# EasyEDA Pro project ProDoc_OHPP-005B.epro, schematic OHPP-005B

## Sheets
1 P1: Board Name: Board1; Create Date: 2025-08-12; Page Name: P1; Project Name: OHPP-005-Breakout Adapter for Radio Boards; Schematic Name: Schematic1; Update Date: 2025-08-12; Company: EasyEDA.com; Page Size: A4; Version: V1.0
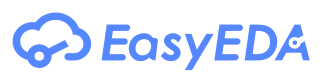
[diagram p0: P1]
2 P2: Page Name: P2
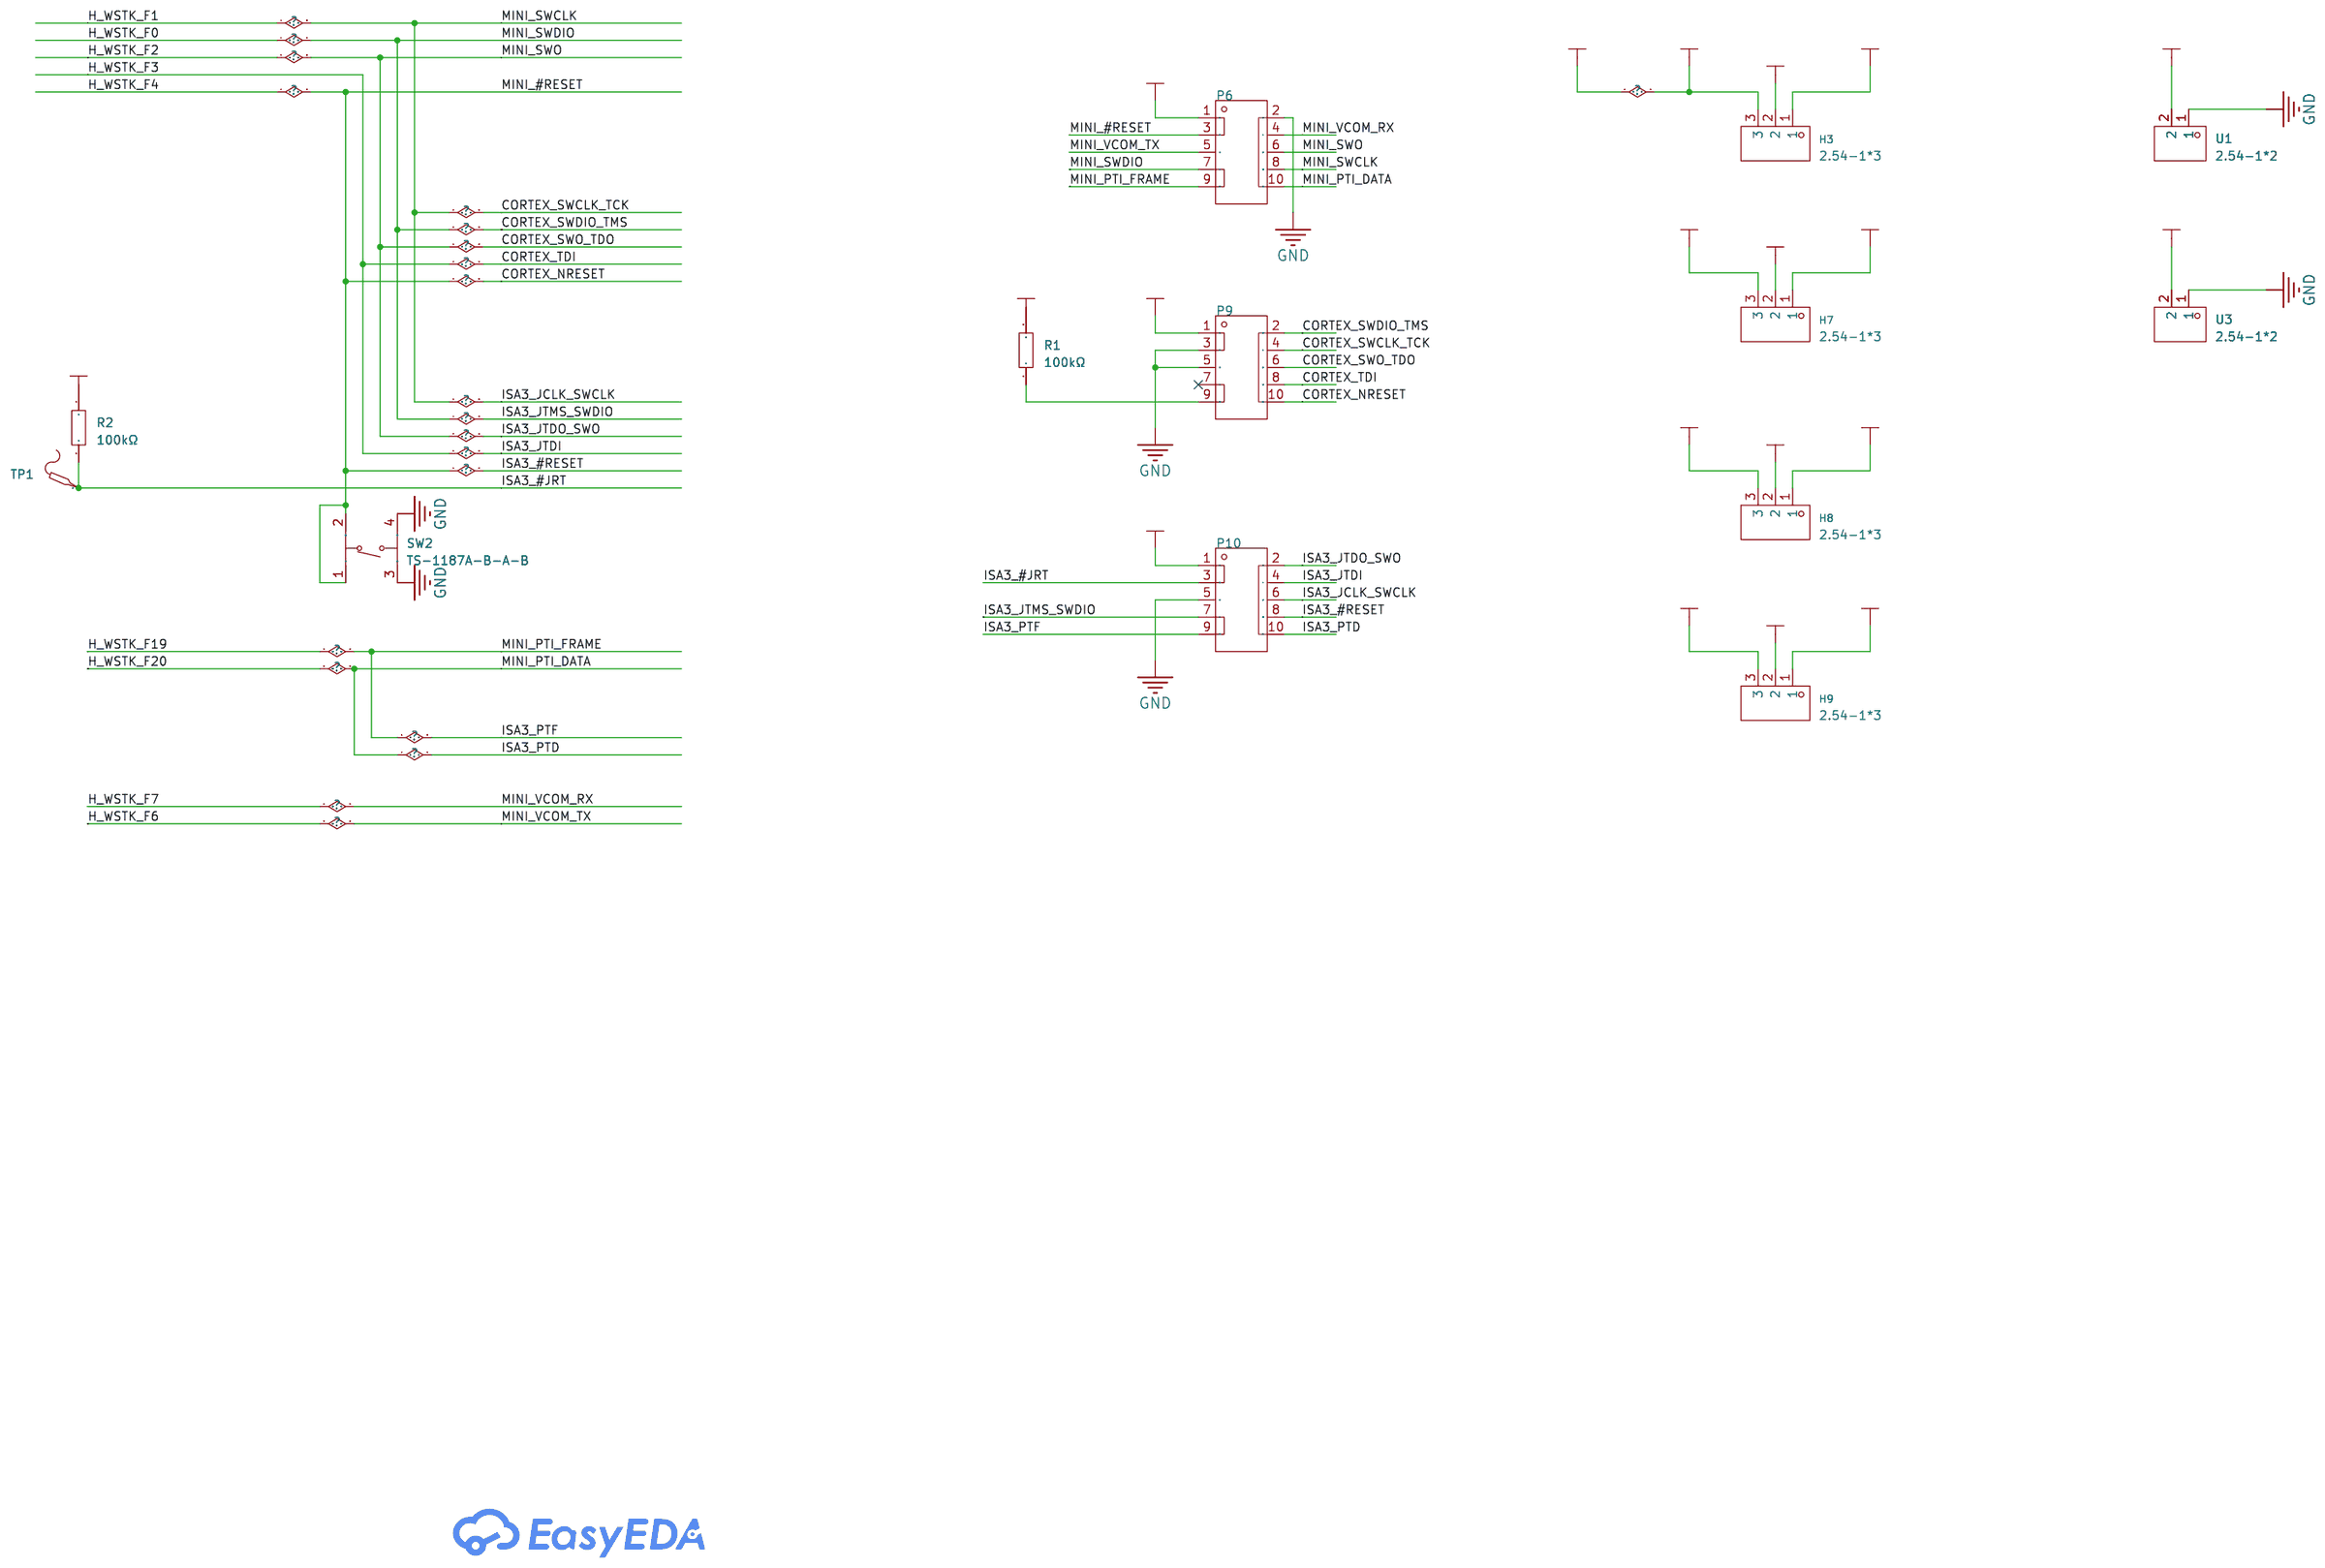
[diagram p1: P2]
3 P3: Board Name: OHPP-005B; Page Name: P3; Schematic Name: OHPP-005B; Update Date: 2025-08-13
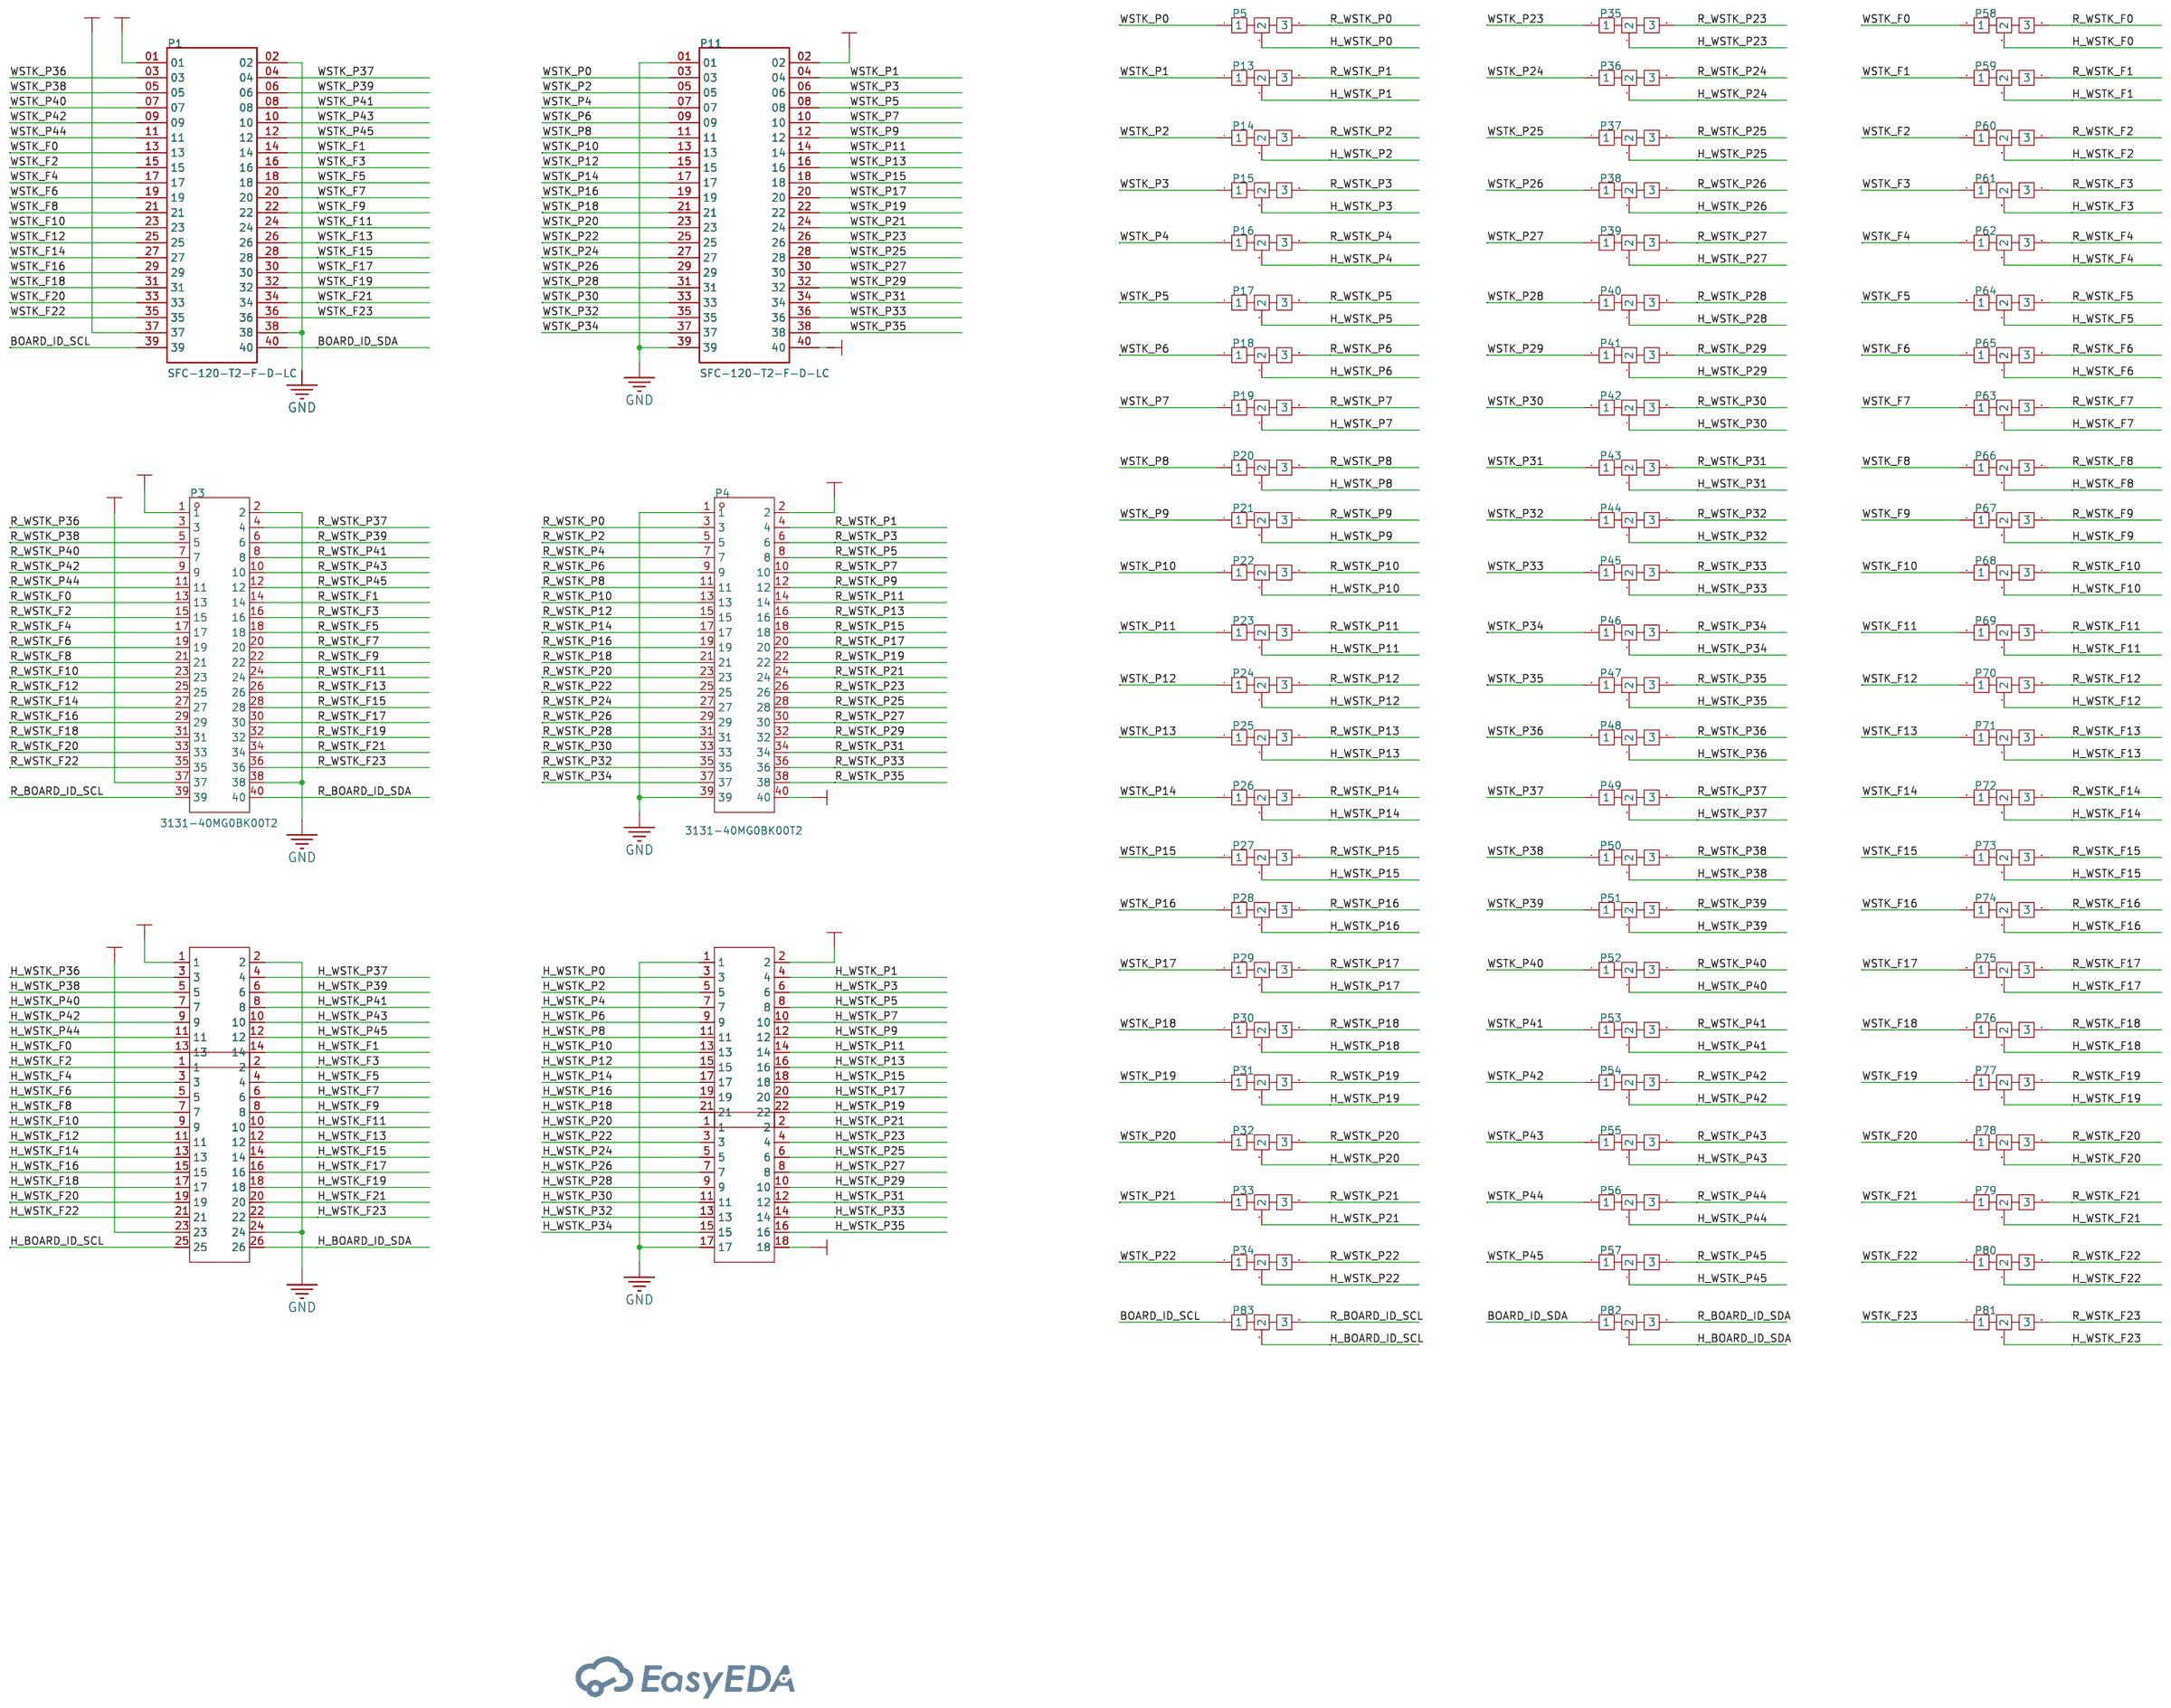
[diagram p2: P3]

## Parts
sheet P2
H3  2.54-1*3  [HDR-TH_3P-P2.54-V-M-1]
H7  2.54-1*3  [HDR-TH_3P-P2.54-V-M-1]
H8  2.54-1*3  [HDR-TH_3P-P2.54-V-M-1]
H9  2.54-1*3  [HDR-TH_3P-P2.54-V-M-1]
P6  23bddce16d364f51bbc85156d37ba6bb  [IDC-SMD_3132-10MG0BK00R2_1]
P9  23bddce16d364f51bbc85156d37ba6bb  [IDC-SMD_3132-10MG0BK00R2_1]
P10  23bddce16d364f51bbc85156d37ba6bb  [IDC-SMD_3132-10MG0BK00R2_1]
R1  100kΩ  [R0603]
R2  100kΩ  [R0603]
SW2  TS-1187A-B-A-B  [SW-SMD_4P-L5.1-W5.1-P3.70-LS6.5-TL_H1.5]
TP1  -  [Test-Point-0.5mm]
U1  2.54-1*2  [HDR-TH_2P-P2.54-V-M]
U3  2.54-1*2  [HDR-TH_2P-P2.54-V-M]
sheet P3
H15  X6521WV-2x09H-C60D30  [HDR-TH_18P-P2.54-V-M-R2-C9-S2.54]
H16  X6521WV-2x11H-C60D30  [HDR-TH_22P-2.54-V-M-R2-C11-S2.54]
H17  X6521WV-2x13H-C60D30  [HDR-TH_26P-P2.54-V-M-R2-C13-S2.54]
H18  X6521WV-2x07H-C60D30  [HDR-TH_14P-P2.54-V-M-R2-C7-S2.54]
P1  *  [SAMTEC_SFC-120-T2-F-D-LC_1]
P3  3131-40MG0BK00T2  [CONN-SMD_40P-P1.27_WCON_3131-40MG0BK00T2_1]
P4  3131-40MG0BK00T2  [CONN-SMD_40P-P1.27_WCON_3131-40MG0BK00T2_1]
P5  -  [JUMPER_RECT_3PIN_NSNS]
P11  *  [SAMTEC_SFC-120-T2-F-D-LC_1]
P13  -  [JUMPER_RECT_3PIN_NSNS]
P14  -  [JUMPER_RECT_3PIN_NSNS]
P15  -  [JUMPER_RECT_3PIN_NSNS]
P16  -  [JUMPER_RECT_3PIN_NSNS]
P17  -  [JUMPER_RECT_3PIN_NSNS]
P18  -  [JUMPER_RECT_3PIN_NSNS]
P19  -  [JUMPER_RECT_3PIN_NSNS]
P20  -  [JUMPER_RECT_3PIN_NSNS]
P21  -  [JUMPER_RECT_3PIN_NSNS]
P22  -  [JUMPER_RECT_3PIN_NSNS]
P23  -  [JUMPER_RECT_3PIN_NSNS]
P24  -  [JUMPER_RECT_3PIN_NSNS]
P25  -  [JUMPER_RECT_3PIN_NSNS]
P26  -  [JUMPER_RECT_3PIN_NSNS]
P27  -  [JUMPER_RECT_3PIN_NSNS]
P28  -  [JUMPER_RECT_3PIN_NSNS]
P29  -  [JUMPER_RECT_3PIN_NSNS]
P30  -  [JUMPER_RECT_3PIN_NSNS]
P31  -  [JUMPER_RECT_3PIN_NSNS]
P32  -  [JUMPER_RECT_3PIN_NSNS]
P33  -  [JUMPER_RECT_3PIN_NSNS]
P34  -  [JUMPER_RECT_3PIN_NSNS]
P35  -  [JUMPER_RECT_3PIN_NSNS]
P36  -  [JUMPER_RECT_3PIN_NSNS]
P37  -  [JUMPER_RECT_3PIN_NSNS]
P38  -  [JUMPER_RECT_3PIN_NSNS]
P39  -  [JUMPER_RECT_3PIN_NSNS]
P40  -  [JUMPER_RECT_3PIN_NSNS]
P41  -  [JUMPER_RECT_3PIN_NSNS]
P42  -  [JUMPER_RECT_3PIN_NSNS]
P43  -  [JUMPER_RECT_3PIN_NSNS]
P44  -  [JUMPER_RECT_3PIN_NSNS]
P45  -  [JUMPER_RECT_3PIN_NSNS]
P46  -  [JUMPER_RECT_3PIN_NSNS]
P47  -  [JUMPER_RECT_3PIN_NSNS]
P48  -  [JUMPER_RECT_3PIN_NSNS]
P49  -  [JUMPER_RECT_3PIN_NSNS]
P50  -  [JUMPER_RECT_3PIN_NSNS]
P51  -  [JUMPER_RECT_3PIN_NSNS]
P52  -  [JUMPER_RECT_3PIN_NSNS]
P53  -  [JUMPER_RECT_3PIN_NSNS]
P54  -  [JUMPER_RECT_3PIN_NSNS]
P55  -  [JUMPER_RECT_3PIN_NSNS]
P56  -  [JUMPER_RECT_3PIN_NSNS]
P57  -  [JUMPER_RECT_3PIN_NSNS]
P58  -  [JUMPER_RECT_3PIN_NSNS]
P59  -  [JUMPER_RECT_3PIN_NSNS]
P60  -  [JUMPER_RECT_3PIN_NSNS]
P61  -  [JUMPER_RECT_3PIN_NSNS]
P62  -  [JUMPER_RECT_3PIN_NSNS]
P63  -  [JUMPER_RECT_3PIN_NSNS]
P64  -  [JUMPER_RECT_3PIN_NSNS]
P65  -  [JUMPER_RECT_3PIN_NSNS]
P66  -  [JUMPER_RECT_3PIN_NSNS]
P67  -  [JUMPER_RECT_3PIN_NSNS]
P68  -  [JUMPER_RECT_3PIN_NSNS]
P69  -  [JUMPER_RECT_3PIN_NSNS]
P70  -  [JUMPER_RECT_3PIN_NSNS]
P71  -  [JUMPER_RECT_3PIN_NSNS]
P72  -  [JUMPER_RECT_3PIN_NSNS]
P73  -  [JUMPER_RECT_3PIN_NSNS]
P74  -  [JUMPER_RECT_3PIN_NSNS]
P75  -  [JUMPER_RECT_3PIN_NSNS]
P76  -  [JUMPER_RECT_3PIN_NSNS]
P77  -  [JUMPER_RECT_3PIN_NSNS]
P78  -  [JUMPER_RECT_3PIN_NSNS]
P79  -  [JUMPER_RECT_3PIN_NSNS]
P80  -  [JUMPER_RECT_3PIN_NSNS]
P81  -  [JUMPER_RECT_3PIN_NSNS]
P82  -  [JUMPER_RECT_3PIN_NSNS]
P83  -  [JUMPER_RECT_3PIN_NSNS]

## Library data of the parts
H3 H7-H9 = 2.54-1*3: Pin Structure:1x3P Pitch:2.54mm Number of Rows:Plugin Number of Pins:3P Contact Plating:Gold; LCSC Part Name: 停产; Supplier Part: C5116482; Manufacturer: ZHOURI(洲日); Supplier Footprint: 插件,P=2.54mm; Datasheet: https://atta.szlcsc.com/upload/public/pdf/source/20220729/4DB71EF9013296CFACD97372BAB8A1F0.pdf; Supplier: LCSC; Pin Structure: 1x3P; Pitch: 2.54mm; Number of Rows: Plugin; Number of Pins: 3P; Contact Plating: Gold
P6 P9 P10 = 3132-10MG0BK00R2_CP_V1.0.0: Connector Type:简牛座 Pitch:1.27mm Structure:2x5P Holder Type:Brick nogging Row Spacing:1.27mm Number of Rows:2 Pin Number in each Row:5 Contact Material:Brass Contact Plating:Gold; Supplier: LCSC; Supplier Part: C783843; Manufacturer: Wcon(维峰电子); Manufacturer Part: 3132-10MG0BK00R2; LCSC Part Name: 1.27mm 2x5P 排数:2 每排P数:5; Supplier Footprint: SMD,P=1.27mm; Datasheet: https://atta.szlcsc.com/upload/public/pdf/source/20200914/C783843_74B4F3B0F5055CA38342214C72674E3E.pdf; Connector Type: 简牛座; Pitch: 1.27mm; Structure: 2x5P; Holder Type: Brick nogging; Row Spacing: 1.27mm; Number of Rows: 2; Pin Number in each Row: 5; Contact Material: Brass; Contact Plating: Gold
R1 R2 = 0603WAF1003T5E: Type:Thick Film Resistors Resistance:100kΩ Tolerance:±1% Tolerance:±1% Power(Watts): Overload Voltage (Max): Temperature Coefficient:±100ppm/℃ Temperature Coefficient:±100ppm/℃ Operating Temperature Range:-55℃~+155℃ Operating Temperature Range:-55℃~+155℃; LCSC Part Name: 100kΩ ±1% 100mW 厚膜电阻; Supplier Part: C25803; Manufacturer: UNI-ROYAL(厚声); Supplier Footprint: 0603; JLCPCB Part Class: Basic Part; Datasheet: https://atta.szlcsc.com/upload/public/pdf/source/20200306/C422600_1E6D84923E4A46A82E41ADD87F860B5C.pdf; Supplier: LCSC; Type: Thick Film Resistors; Tolerance: ±1%; Temperature Coefficient: ±100ppm/℃; Operating Temperature Range: -55℃~+155℃
SW2 = TS-1187A-B-A-B: Circuit:SPST Actuator Style:Round Button Operating Force:160gf Mounting Style:Brick nogging Switch Length:5.1mm Switch Width:5.1mm Switch Height:1.5mm Strike Gundam:不带 Contact Current:50mA Voltage Rating (DC):12V Insulation Resistance:- Actuator/Cap Color; LCSC Part Name: 5.1*5.1*1.5mm 立贴 轻触开关; Supplier Part: C318884; Manufacturer: XKB Connectivity(中国星坤); Supplier Footprint: SMD; JLCPCB Part Class: Basic Part; Datasheet: https://atta.szlcsc.com/upload/public/pdf/source/20200227/C318890_053E50208A88A7BA1965D8746000774E.pdf; Supplier: LCSC; Circuit: SPST; Actuator Style: Round Button; Operating Force: 160gf; Mounting Style: Brick nogging; Switch Length: 5.1mm; Switch Width: 5.1mm; Switch Height: 1.5mm; Strike Gundam: 不带; Contact Current: 50mA; Voltage Rating (DC): 12V; Actuator/Cap Color: 金色; With Lamp: No; Mechanical Life: 10万次; Operating Temperature: -30℃~+85℃
TP1 = Test-Point: Test Point 测试点
U1 U3 = 2.54-1*2: Pin Structure:1x2P Pitch:2.54mm Number of Rows:Plugin Number of Pins:2P Contact Plating:Gold; LCSC Part Name: 停产; Supplier Part: C5116481; Manufacturer: ZHOURI(洲日); Supplier Footprint: 插件,P=2.54mm; Datasheet: https://atta.szlcsc.com/upload/public/pdf/source/20220729/DF18AADA08AA3A4F1D3B0508BB8F7248.pdf; Supplier: LCSC; Pin Structure: 1x2P; Pitch: 2.54mm; Number of Rows: Plugin; Number of Pins: 2P; Contact Plating: Gold
H15 = X6521WV-2x09H-C60D30: Pin Structure:2x9P Pitch:2.54mm Row Spacing:2.54mm Circluar Pins/Square Pins:Pin Header Number of Rows:2 Number of Pins:18P Current Rating:3A Voltage Rating (Max):250V Length of Mating Pin:- Insulation Height:2.5mm Length of End Connection Pin:- Contact M; LCSC Part Name: 2x9P 间距:2.54mm 方针; Supplier Part: C706899; Manufacturer: XKB Connection(中国星坤); Supplier Footprint: 插件,P=2.54mm; JLCPCB Part Class: Extended Part; Datasheet: https://item.szlcsc.com/datasheet/X6521WV-2x09H-C60D30/744021.html; Supplier: LCSC; Pin Structure: 2x9P; Pitch: 2.54mm; Row Spacing: 2.54mm; Circluar Pins/Square Pins: Pin Header; Number of Rows: 2; Number of Pins: 18P; Current Rating: 3A; Voltage Rating (Max): 250V; Insulation Height: 2.5mm; Contact Material: Brass; Contact Plating: Gold; Operating Temperature: -40℃~+105℃; Color: Black
H16 = X6521WV-2x11H-C60D30: Pin Structure:2x11P Pitch:2.54mm Row Spacing:2.54mm Circluar Pins/Square Pins:Policy Number of Rows:Double Row Number of Pins:22P Current Rating:3A Voltage Rating (Max):250V Length of Mating Pin:- Insulation Height:2.5mm Length of End Connection Pin:- Con; LCSC Part Name: 2x11P 间距:2.54mm 方针; Supplier Part: C725883; Manufacturer: XKB Connection(中国星坤); Supplier Footprint: 插件,P=2.54mm; JLCPCB Part Class: Extended Part; Supplier: LCSC; Pin Structure: 2x11P; Pitch: 2.54mm; Row Spacing: 2.54mm; Circluar Pins/Square Pins: Policy; Number of Rows: Double Row; Number of Pins: 22P; Current Rating: 3A; Voltage Rating (Max): 250V; Insulation Height: 2.5mm; Contact Material: Brass; Contact Plating: Gold; Operating Temperature: -40℃~+105℃; Color: Black
H17 = X6521WV-2x13H-C60D30: Pin Structure:2x13P Pitch:2.54mm Row Spacing:2.54mm Circluar Pins/Square Pins:Pin Header Number of Rows:2 Number of Pins:26P Current Rating:3A Voltage Rating (Max):250V Length of Mating Pin:- Insulation Height:2.5mm Length of End Connection Pin:- Contact; LCSC Part Name: 2x13P 间距:2.54mm 方针; Supplier Part: C725885; Manufacturer: XKB Connection(中国星坤); Supplier Footprint: 插件,P=2.54mm; JLCPCB Part Class: Extended Part; Datasheet: https://item.szlcsc.com/datasheet/X6521WV-2x13H-C60D30/772334.html; Supplier: LCSC; Pin Structure: 2x13P; Pitch: 2.54mm; Row Spacing: 2.54mm; Circluar Pins/Square Pins: Pin Header; Number of Rows: 2; Number of Pins: 26P; Current Rating: 3A; Voltage Rating (Max): 250V; Insulation Height: 2.5mm; Contact Material: Brass; Contact Plating: Gold; Operating Temperature: -40℃~+105℃; Color: Black
H18 = X6521WV-2x07H-C60D30: Pin Structure:2x7P Pitch:2.54mm Row Spacing:2.54mm Circluar Pins/Square Pins:Pin Header Number of Rows:2 Number of Pins:14P Current Rating:3A Voltage Rating (Max):250V Length of Mating Pin:- Insulation Height:2.5mm Length of End Connection Pin:- Contact M; LCSC Part Name: 2x7P 间距:2.54mm 方针; Supplier Part: C706897; Manufacturer: XKB Connection(中国星坤); Supplier Footprint: 插件,P=2.54mm; JLCPCB Part Class: Extended Part; Supplier: LCSC; Pin Structure: 2x7P; Pitch: 2.54mm; Row Spacing: 2.54mm; Circluar Pins/Square Pins: Pin Header; Number of Rows: 2; Number of Pins: 14P; Current Rating: 3A; Voltage Rating (Max): 250V; Insulation Height: 2.5mm; Contact Material: Brass; Contact Plating: Gold; Operating Temperature: -40℃~+105℃; Color: Black
P1 P11 = SFC-120-T2-F-D-LC_CP-V1.0.0: Package1: None; Price: None; MP: SFC-120-T2-F-D-LC; Availability: Unavailable
P3 P4 = 3131-40MG0BK00T2_CP_V1.0.1: Connector Type:Simple cow constellation Pitch:1.27mm Number of Positions or Pins:2x20P Current Rating:1A Voltage Rating (Max):- Holder Type:Standing paste Row Spacing:1.27mm Number of Rows:2 Number of PINs Per Row:20 Operating Temperature:-40℃~+105℃ Opera; Supplier Part: C976753; Manufacturer: Wcon(维峰电子); Supplier Footprint: SMD,P=1.27mm; Datasheet: https://atta.szlcsc.com/upload/public/pdf/source/20211202/B702BBAB0AED51B28E1877A6EDDD5ECD.pdf; Supplier: LCSC; Connector Type: Simple cow constellation; Pitch: 1.27mm; Number of Positions or Pins: 2x20P; Current Rating: 1A; Holder Type: Standing paste; Row Spacing: 1.27mm; Number of Rows: 2; Number of PINs Per Row: 20; Operating Temperature: -40℃~+105℃
P5 P13-P83 = JUMPER_RECT_3PIN_NSNS

## Nets
3V3: H8.3 P1.01
5V: H9.3 P1.37
GND: H15.17 H16.1 H17.24 H18.2 P1.02 P1.38 P3.2 P3.38 P4.1 P4.39 P6.2 P9.3 P9.5 P10.5 P11.01 P11.39 SW2.3(C) SW2.4(D) U1.1 U3.1
BOARD_ID_SCL: P1.39 P83.1
BOARD_ID_SDA: P1.40 P82.1
CORTEX_NRESET: H17.3 P6.3 P9.10 P10.8 P62.2 SW2.1(A) SW2.2(B)
CORTEX_SWCLK_TCK: H18.14 P6.8 P9.4 P10.6 P59.2
CORTEX_SWDIO_TMS: H18.13 P6.7 P9.2 P10.7 P58.2
CORTEX_SWO_TDO: H17.1 P6.6 P9.6 P10.2 P60.2
CORTEX_TDI: H17.2 P9.8 P10.4 P61.2
EXT_3V3: H3.1 H7.1 H8.1 U1.2
EXT_5V: H9.1 U3.2
H_BOARD_ID_SCL: H17.25 P83.2
H_BOARD_ID_SDA: H17.26 P82.2
H_WSTK_F5: H17.4 P64.2
H_WSTK_F6: H17.5 P6.5 P65.2
H_WSTK_F7: H17.6 P6.4 P63.2
H_WSTK_F8: H17.7 P66.2
H_WSTK_F9: H17.8 P67.2
H_WSTK_F10: H17.9 P68.2
H_WSTK_F11: H17.10 P69.2
H_WSTK_F12: H17.11 P70.2
H_WSTK_F13: H17.12 P71.2
H_WSTK_F14: H17.13 P72.2
H_WSTK_F15: H17.14 P73.2
H_WSTK_F16: H17.15 P74.2
H_WSTK_F17: H17.16 P75.2
H_WSTK_F18: H17.17 P76.2
H_WSTK_F19: H17.18 P6.9 P10.9 P77.2
H_WSTK_F20: H17.19 P6.10 P10.10 P78.2
H_WSTK_F21: H17.20 P79.2
H_WSTK_F22: H17.21 P80.2
H_WSTK_F23: H17.22 P81.2
H_WSTK_P0: H16.3 P5.2
H_WSTK_P1: H16.4 P13.2
H_WSTK_P2: H16.5 P14.2
H_WSTK_P3: H16.6 P15.2
H_WSTK_P4: H16.7 P16.2
H_WSTK_P5: H16.8 P17.2
H_WSTK_P6: H16.9 P18.2
H_WSTK_P7: H16.10 P19.2
H_WSTK_P8: H16.11 P20.2
H_WSTK_P9: H16.12 P21.2
H_WSTK_P10: H16.13 P22.2
H_WSTK_P11: H16.14 P23.2
H_WSTK_P12: H16.15 P24.2
H_WSTK_P13: H16.16 P25.2
H_WSTK_P14: H16.17 P26.2
H_WSTK_P15: H16.18 P27.2
H_WSTK_P16: H16.19 P28.2
H_WSTK_P17: H16.20 P29.2
H_WSTK_P18: H16.21 P30.2
H_WSTK_P19: H16.22 P31.2
H_WSTK_P20: H15.1 P32.2
H_WSTK_P21: H15.2 P33.2
H_WSTK_P22: H15.3 P34.2
H_WSTK_P23: H15.4 P35.2
H_WSTK_P24: H15.5 P36.2
H_WSTK_P25: H15.6 P37.2
H_WSTK_P26: H15.7 P38.2
H_WSTK_P27: H15.8 P39.2
H_WSTK_P28: H15.9 P40.2
H_WSTK_P29: H15.10 P41.2
H_WSTK_P30: H15.11 P42.2
H_WSTK_P31: H15.12 P43.2
H_WSTK_P32: H15.13 P44.2
H_WSTK_P33: H15.14 P45.2
H_WSTK_P34: H15.15 P46.2
H_WSTK_P35: H15.16 P47.2
H_WSTK_P36: H18.3 P48.2
H_WSTK_P37: H18.4 P49.2
H_WSTK_P38: H18.5 P50.2
H_WSTK_P39: H18.6 P51.2
H_WSTK_P40: H18.7 P52.2
H_WSTK_P41: H18.8 P53.2
H_WSTK_P42: H18.9 P54.2
H_WSTK_P43: H18.10 P55.2
H_WSTK_P44: H18.11 P56.2
H_WSTK_P45: H18.12 P57.2
ISA3_#JRT: P10.3 R2.1 TP1.1
R_3V3: H8.2 H18.1 P3.1
R_5V: H9.2 H17.23 P3.37
R_BOARD_ID_SCL: P3.39 P83.3
R_BOARD_ID_SDA: P3.40 P82.3
R_VMCU_IN: H3.2 H16.2 P4.2
R_VRF_IN: H7.2 H15.18 P4.40
R_WSTK_F0: P3.13 P58.3
R_WSTK_F1: P3.14 P59.3
R_WSTK_F2: P3.15 P60.3
R_WSTK_F3: P3.16 P61.3
R_WSTK_F4: P3.17 P62.3
R_WSTK_F5: P3.18 P64.3
R_WSTK_F6: P3.19 P65.3
R_WSTK_F7: P3.20 P63.3
R_WSTK_F8: P3.21 P66.3
R_WSTK_F9: P3.22 P67.3
R_WSTK_F10: P3.23 P68.3
R_WSTK_F11: P3.24 P69.3
R_WSTK_F12: P3.25 P70.3
R_WSTK_F13: P3.26 P71.3
R_WSTK_F14: P3.27 P72.3
R_WSTK_F15: P3.28 P73.3
R_WSTK_F16: P3.29 P74.3
R_WSTK_F17: P3.30 P75.3
R_WSTK_F18: P3.31 P76.3
R_WSTK_F19: P3.32 P77.3
R_WSTK_F20: P3.33 P78.3
R_WSTK_F21: P3.34 P79.3
R_WSTK_F22: P3.35 P80.3
R_WSTK_F23: P3.36 P81.3
R_WSTK_P0: P4.3 P5.3
R_WSTK_P1: P4.4 P13.3
R_WSTK_P2: P4.5 P14.3
R_WSTK_P3: P4.6 P15.3
R_WSTK_P4: P4.7 P16.3
R_WSTK_P5: P4.8 P17.3
R_WSTK_P6: P4.9 P18.3
R_WSTK_P7: P4.10 P19.3
R_WSTK_P8: P4.11 P20.3
R_WSTK_P9: P4.12 P21.3
R_WSTK_P10: P4.13 P22.3
R_WSTK_P11: P4.14 P23.3
R_WSTK_P12: P4.15 P24.3
R_WSTK_P13: P4.16 P25.3
R_WSTK_P14: P4.17 P26.3
R_WSTK_P15: P4.18 P27.3
R_WSTK_P16: P4.19 P28.3
R_WSTK_P17: P4.20 P29.3
R_WSTK_P18: P4.21 P30.3
R_WSTK_P19: P4.22 P31.3
R_WSTK_P20: P4.23 P32.3
R_WSTK_P21: P4.24 P33.3
R_WSTK_P22: P4.25 P34.3
R_WSTK_P23: P4.26 P35.3
R_WSTK_P24: P4.27 P36.3
R_WSTK_P25: P4.28 P37.3
R_WSTK_P26: P4.29 P38.3
R_WSTK_P27: P4.30 P39.3
R_WSTK_P28: P4.31 P40.3
R_WSTK_P29: P4.32 P41.3
R_WSTK_P30: P4.33 P42.3
R_WSTK_P31: P4.34 P43.3
R_WSTK_P32: P4.35 P44.3
R_WSTK_P33: P4.36 P45.3
R_WSTK_P34: P4.37 P46.3
R_WSTK_P35: P4.38 P47.3
R_WSTK_P36: P3.3 P48.3
R_WSTK_P37: P3.4 P49.3
R_WSTK_P38: P3.5 P50.3
R_WSTK_P39: P3.6 P51.3
R_WSTK_P40: P3.7 P52.3
R_WSTK_P41: P3.8 P53.3
R_WSTK_P42: P3.9 P54.3
R_WSTK_P43: P3.10 P55.3
R_WSTK_P44: P3.11 P56.3
R_WSTK_P45: P3.12 P57.3
VMCU_DEBUG: H3.3 P6.1 P9.1 P10.1 P11.02 R1.2 R2.2
VRF_IN: H7.3 P11.40
WSTK_F0: P1.13 P58.1
WSTK_F1: P1.14 P59.1
WSTK_F2: P1.15 P60.1
WSTK_F3: P1.16 P61.1
WSTK_F4: P1.17 P62.1
WSTK_F5: P1.18 P64.1
WSTK_F6: P1.19 P65.1
WSTK_F7: P1.20 P63.1
WSTK_F8: P1.21 P66.1
WSTK_F9: P1.22 P67.1
WSTK_F10: P1.23 P68.1
WSTK_F11: P1.24 P69.1
WSTK_F12: P1.25 P70.1
WSTK_F13: P1.26 P71.1
WSTK_F14: P1.27 P72.1
WSTK_F15: P1.28 P73.1
WSTK_F16: P1.29 P74.1
WSTK_F17: P1.30 P75.1
WSTK_F18: P1.31 P76.1
WSTK_F19: P1.32 P77.1
WSTK_F20: P1.33 P78.1
WSTK_F21: P1.34 P79.1
WSTK_F22: P1.35 P80.1
WSTK_F23: P1.36 P81.1
WSTK_P0: P5.1 P11.03
WSTK_P1: P11.04 P13.1
WSTK_P2: P11.05 P14.1
WSTK_P3: P11.06 P15.1
WSTK_P4: P11.07 P16.1
WSTK_P5: P11.08 P17.1
WSTK_P6: P11.09 P18.1
WSTK_P7: P11.10 P19.1
WSTK_P8: P11.11 P20.1
WSTK_P9: P11.12 P21.1
WSTK_P10: P11.13 P22.1
WSTK_P11: P11.14 P23.1
WSTK_P12: P11.15 P24.1
WSTK_P13: P11.16 P25.1
WSTK_P14: P11.17 P26.1
WSTK_P15: P11.18 P27.1
WSTK_P16: P11.19 P28.1
WSTK_P17: P11.20 P29.1
WSTK_P18: P11.21 P30.1
WSTK_P19: P11.22 P31.1
WSTK_P20: P11.23 P32.1
WSTK_P21: P11.24 P33.1
WSTK_P22: P11.25 P34.1
WSTK_P23: P11.26 P35.1
WSTK_P24: P11.27 P36.1
WSTK_P25: P11.28 P37.1
WSTK_P26: P11.29 P38.1
WSTK_P27: P11.30 P39.1
WSTK_P28: P11.31 P40.1
WSTK_P29: P11.32 P41.1
WSTK_P30: P11.33 P42.1
WSTK_P31: P11.34 P43.1
WSTK_P32: P11.35 P44.1
WSTK_P33: P11.36 P45.1
WSTK_P34: P11.37 P46.1
WSTK_P35: P11.38 P47.1
WSTK_P36: P1.03 P48.1
WSTK_P37: P1.04 P49.1
WSTK_P38: P1.05 P50.1
WSTK_P39: P1.06 P51.1
WSTK_P40: P1.07 P52.1
WSTK_P41: P1.08 P53.1
WSTK_P42: P1.09 P54.1
WSTK_P43: P1.10 P55.1
WSTK_P44: P1.11 P56.1
WSTK_P45: P1.12 P57.1
$2N1020: P9.9 R1.1

Not connected (* = marked no-connect by the designer): P9 7*
